# Altium schematic sheet PowerSys.DiagrammaStrutturaleH.SchDoc
size 420 x 297 mm; Address1: Address1; Address2: Address2; Address3: Address3; Address4: Address4; SheetNumber: 1; Scale: 1:1; Разраб.: Иванов; Обозначение документа: АБВГ.123456.001 Э3; Пров.: Петров; Утв.: Сидоров; Наименование организации: ОАО "Концерн "МПО-Гидроприбор"; Перв. применение: АБВГ.123456.000; Наименование изделия 1: Плата; Наименование изделия 2: Схема электрическая; Наименование изделия 3: принципиальная; Нач. отд.: Нач. отд.; Фамилия нач. отд.: Сидоров
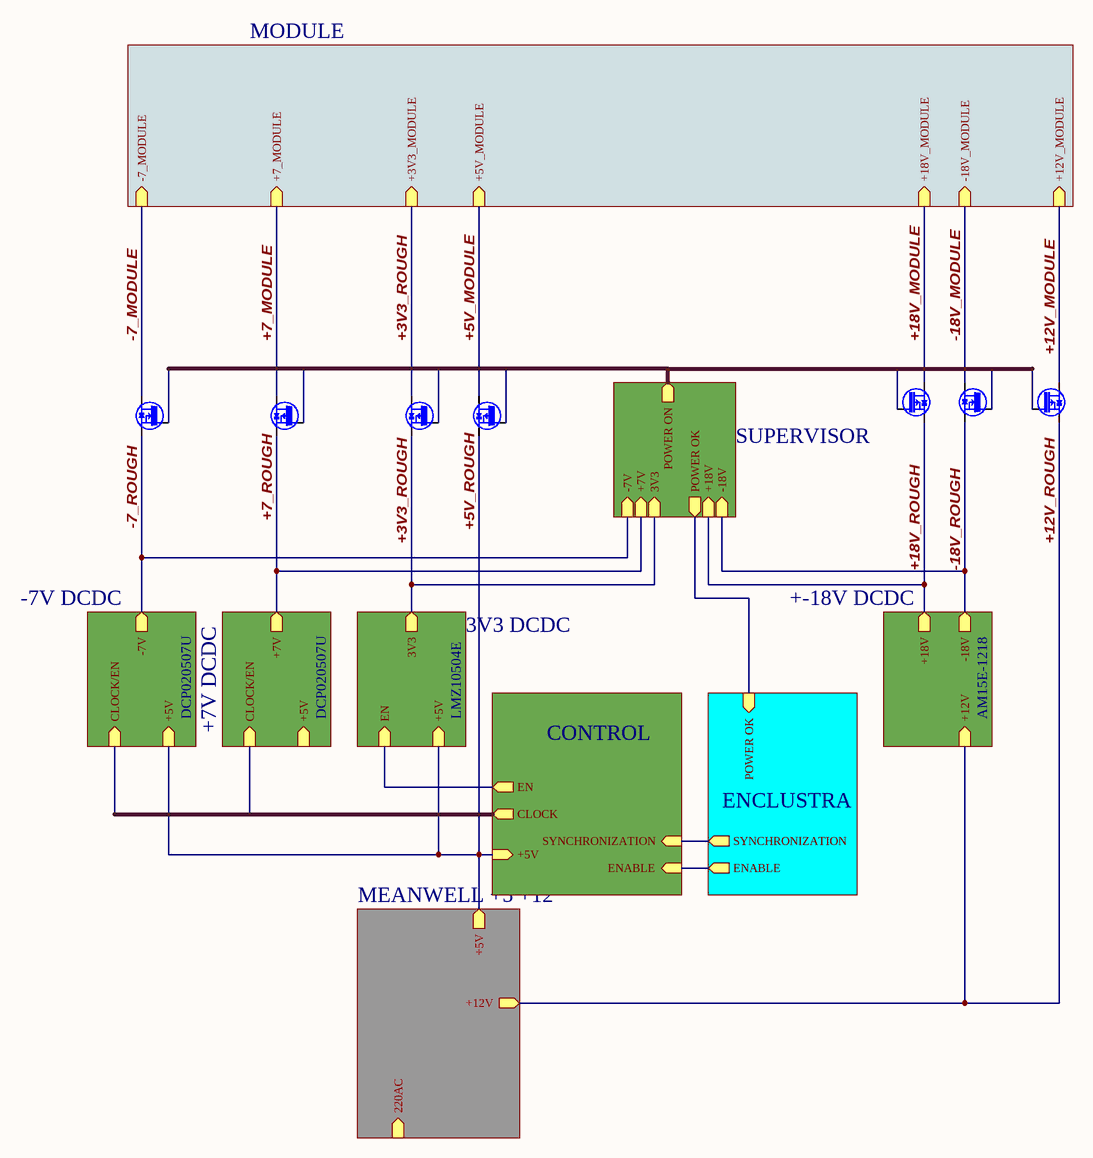
[diagram p0: PowerSys.DiagrammaStrutturaleH.SchDoc]

## Parts
(Parts that share a designator on the sheet are numbered #1, #2 ... from top to bottom, then left to right.)
Q?#1  AO3401A  [SOT95P229X119-3N]  (value not drawn)
Q?#2  AO3400A  [SOT95P229X119-3N]  (value not drawn)
Q?#3  AO3401A  [SOT95P229X119-3N]  (value not drawn)
Q?#4  AO3400A  [SOT95P229X119-3N]  (value not drawn)
Q?#5  AO3401A  [SOT95P229X119-3N]  (value not drawn)
Q?#6  AO3401A  [SOT95P229X119-3N]  (value not drawn)
Q?#7  AO3401A  [SOT95P229X119-3N]  (value not drawn)

## Sub-sheets
3V3 DCDC = File Name: +5V (in), EN (in), 3V3 (out)
+7V DCDC = File Name: +7V (out), +5V (in), CLOCK/EN (in)
+-18V DCDC = File Name: +18V (out), +12V (in), -18V (out)
-7V DCDC = File Name: -7V (out), +5V (in), CLOCK/EN (in)
CONTROL = File Name: ENABLE (in), SYNCHRONIZATION (in), +5V (in), CLOCK (out), EN (out)
ENCLUSTRA = File Name: ENABLE (out), POWER OK (in), SYNCHRONIZATION (out)
MEANWELL +5 +12 = File Name: +5V (out), +12V (out), 220AC (in)
MODULE = File Name: -18V_MODULE (in), +18V_MODULE (in), +5V_MODULE (in), +3V3_MODULE (in), +7_MODULE (in), -7_MODULE (in), +12V_MODULE (in)
SUPERVISOR = File Name: POWER ON (out), 3V3 (in), -18V (in), +18V (in), +7V (in), -7V (in), POWER OK (out)

## Nets
+3V3_ROUGH: Q?#6.2(S) Q?#6.3(D) ; sheet 3V3 DCDC/3V3, sheet SUPERVISOR/3V3, sheet MODULE/+3V3_MODULE
+5V_MODULE: Q?#7.3(D) ; sheet MODULE/+5V_MODULE
+5V_ROUGH: Q?#7.2(S) ; sheet MEANWELL +5 +12/+5V, sheet 3V3 DCDC/+5V, sheet CONTROL/+5V, sheet -7V DCDC/+5V
+7_MODULE: Q?#5.3(D) ; sheet MODULE/+7_MODULE
+7_ROUGH: Q?#5.2(S) ; sheet +7V DCDC/+7V, sheet SUPERVISOR/+7V
+12V_MODULE: Q?#3.3(D) ; sheet MODULE/+12V_MODULE
+12V_ROUGH: Q?#3.2(S) ; sheet MEANWELL +5 +12/+12V, sheet +-18V DCDC/+12V
+18V_MODULE: Q?#1.3(D) ; sheet MODULE/+18V_MODULE
+18V_ROUGH: Q?#1.2(S) Q?#2.2(S) ; sheet +-18V DCDC/+18V, sheet +-18V DCDC/-18V, sheet SUPERVISOR/-18V, sheet SUPERVISOR/+18V  [also labelled -18V_ROUGH]
-7_MODULE: Q?#4.3(D) ; sheet MODULE/-7_MODULE
-7_ROUGH: Q?#4.2(S) ; sheet -7V DCDC/-7V, sheet SUPERVISOR/-7V
-18V_MODULE: Q?#2.3(D) ; sheet MODULE/-18V_MODULE
(unnamed): sheet 3V3 DCDC/EN, sheet CONTROL/EN
(unnamed): sheet CONTROL/ENABLE, sheet ENCLUSTRA/ENABLE
(unnamed): sheet CONTROL/SYNCHRONIZATION, sheet ENCLUSTRA/SYNCHRONIZATION
(unnamed): sheet ENCLUSTRA/POWER OK, sheet SUPERVISOR/POWER OK

Not connected (* = marked no-connect by the designer): Q?#1 1(G); Q?#2 1(G); Q?#3 1(G); Q?#4 1(G); Q?#5 1(G); Q?#6 1(G); Q?#7 1(G)

## Notes on the sheet
- DCP020507U
- LMZ10504E
- AM15E-1218
- Подп. и дата
- Инв. № дубл.
- Взам. инв. №
- Инв. № подл.
- Изм.
- Лист
- № докум.
- Подп.
- Дата
- Копировал
- Формат А3

## Library data of the parts
Q?#1 Q?#3 Q?#5-Q?#7 = AO3401A: PMOS; Vendor: UMW; Pkg: SOT23; SMD Solders: 3; Solder Option: RM; THD Solders: 0; Voltage: -30V; Price: 10; Device: AO3401A; Name to order: AO3401A
Q?#2 Q?#4 = AO3400A: NMOS; Vendor: UMW; Pkg: SOT23; SMD Solders: 3; Solder Option: RM; Voltage: 30V; Price: 10; Device: AO3400A; Name to order: AO3400A